# EAGLE schematic SCREW (EAGLE 7.6.0)
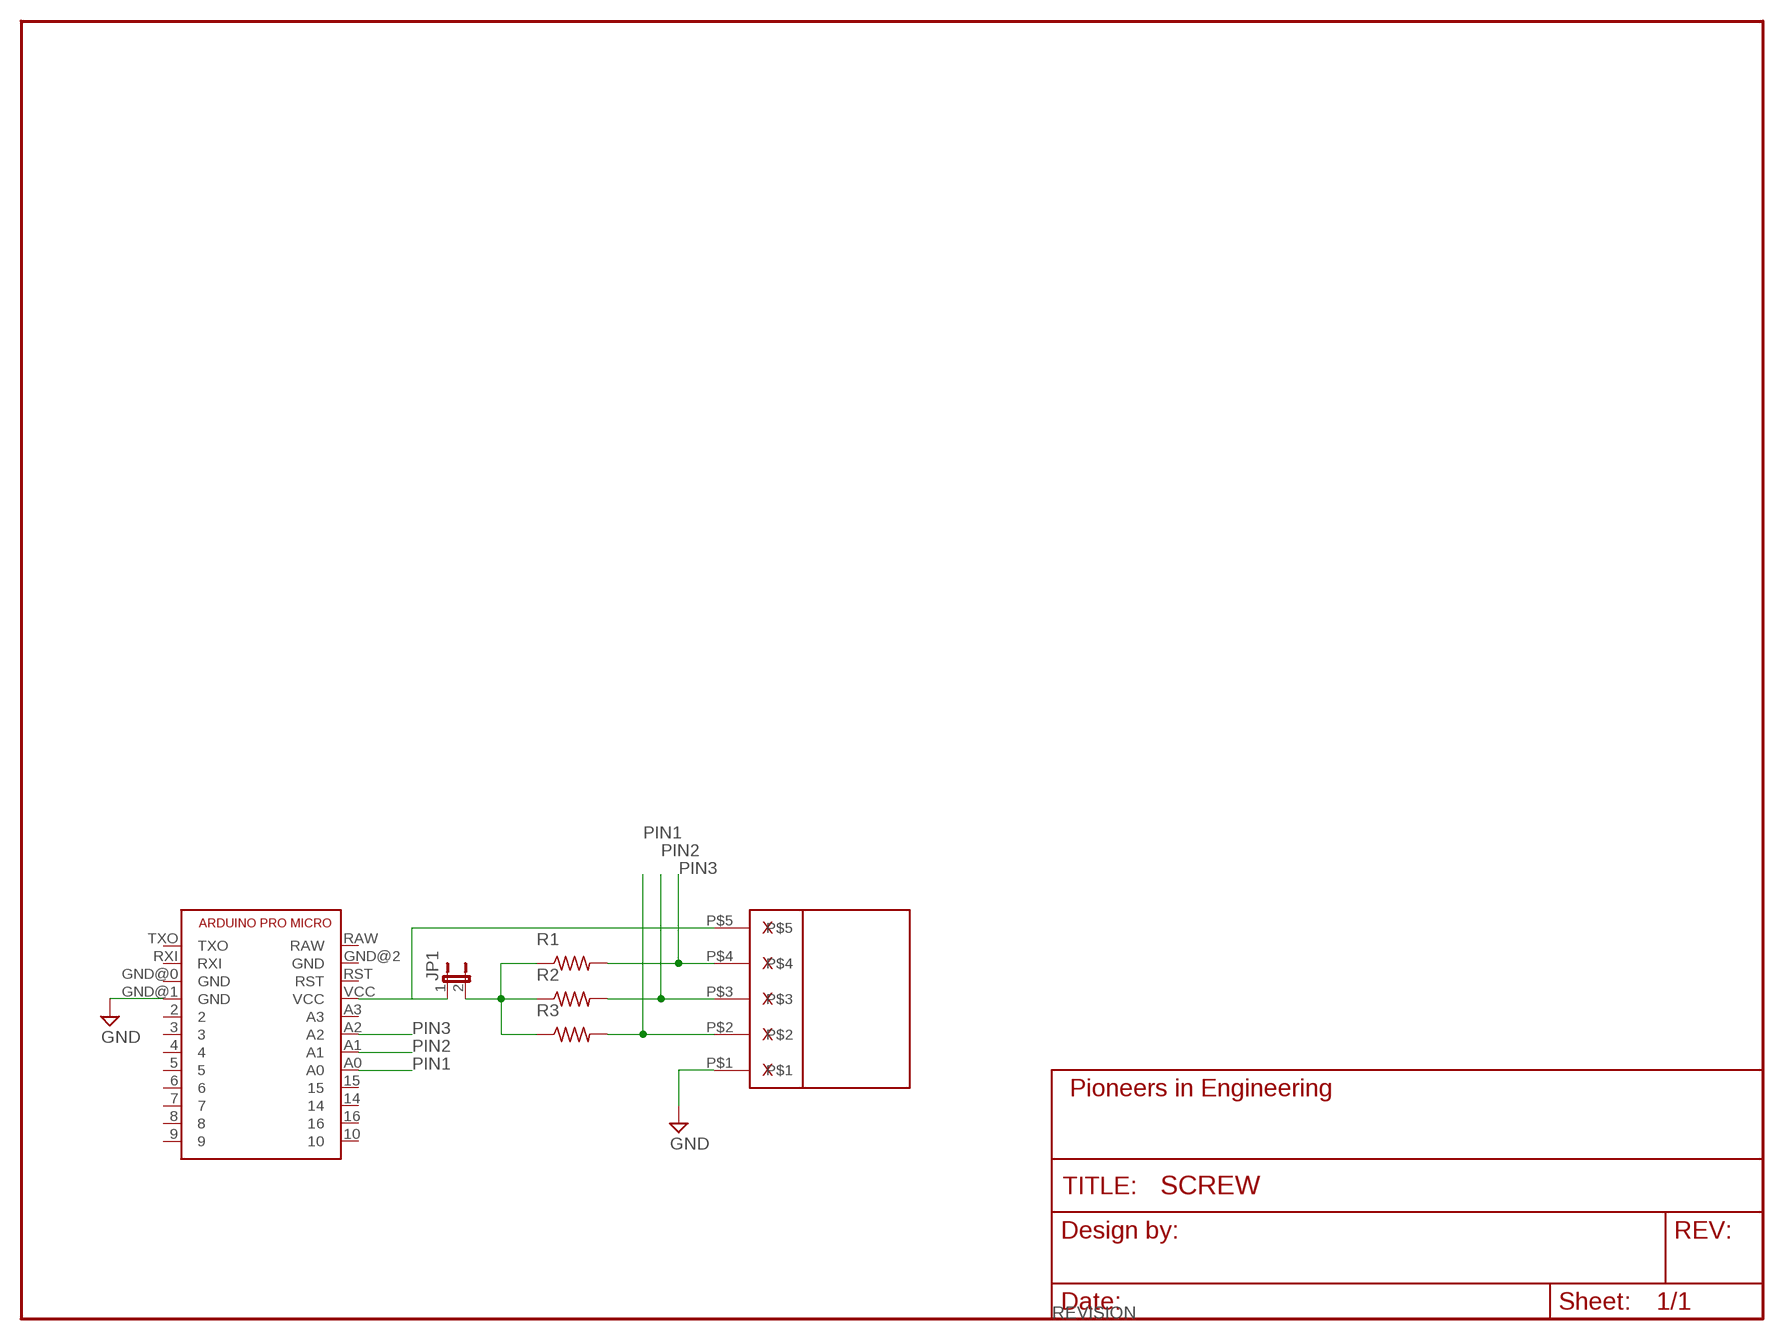
[diagram p0: schematic, sheet 1]
FRAME1 (FRAME-LETTER): REVISION: A

## Parts
JP1  JP1E  [JP1]
R1  R-US_R0603  [R0603]
R2  R-US_R0603  [R0603]
R3  R-US_R0603  [R0603]
U$1  5PIN_SCREW  [5PIN_SCREW]
U$2  ARDUINO_PRO_MICRO  [ARDUINO_PRO_MICRO]

## Nets
5V: JP1.2 R1.1 R2.1 R3.1
GND: U$1.P$1 U$2.GND@1(GND)
PIN1: R3.2 U$1.P$2 U$2.A0
PIN2: R2.2 U$1.P$3 U$2.A1
PIN3: R1.2 U$1.P$4 U$2.A2
VCC: JP1.1 U$1.P$5 U$2.VCC
Unconnected: U$2.2 U$2.3 U$2.4 U$2.5 U$2.6 U$2.7 U$2.8 U$2.9 U$2.10 U$2.14 U$2.15 U$2.16 U$2.A3 U$2.GND@0(GND) U$2.GND@2(GND) U$2.RAW U$2.RST U$2.RXI U$2.TXO

## Library data of the parts
JP1 = jumper:JP1E: JUMPER
R1-R3 = pie:R-US_: RESISTOR, American symbol; PIE-INT-REF-NUM: RESISTOR-GENERIC
U$1 = pie:5PIN_SCREW: 5 Pin Screw Terminal Sparkfun Page <https://www.sparkfun.com/products/8432> 5mm Pitch The 2 and 3 Pins Screw Terminals can be linked together seamlessly.
U$2 = pie:ARDUINO_PRO_MICRO: Arduino Pro Micro Electrical System Year 9's Smart Sensor Core Pin Outs <https://cdn.sparkfun.com/assets/9/c/3/c/4/523a1765757b7f5c6e8b4567.png> Buy Here <http://www.aliexpress.com/item/Mini-Leonardo-Pro-Micro-ATmega32U4-5V-16MHz-Module-For-Arduino-Best-Quality/32284746884.html?ws_ab_test=searchweb201556_8,searchweb201602_2_10057_10056_10065_10055_10054_10067_10069_10059_10058_10017_10070_10060_10061_10052_10062_10053_10050_10051,searchweb201603_1&btsid=45993952-29ca-4de4-a0fb-c7fb72b8e1a5>